# Altium schematic sheet Sheet2.SchDoc
size A; SheetNumber: 2; SheetTotal: 2
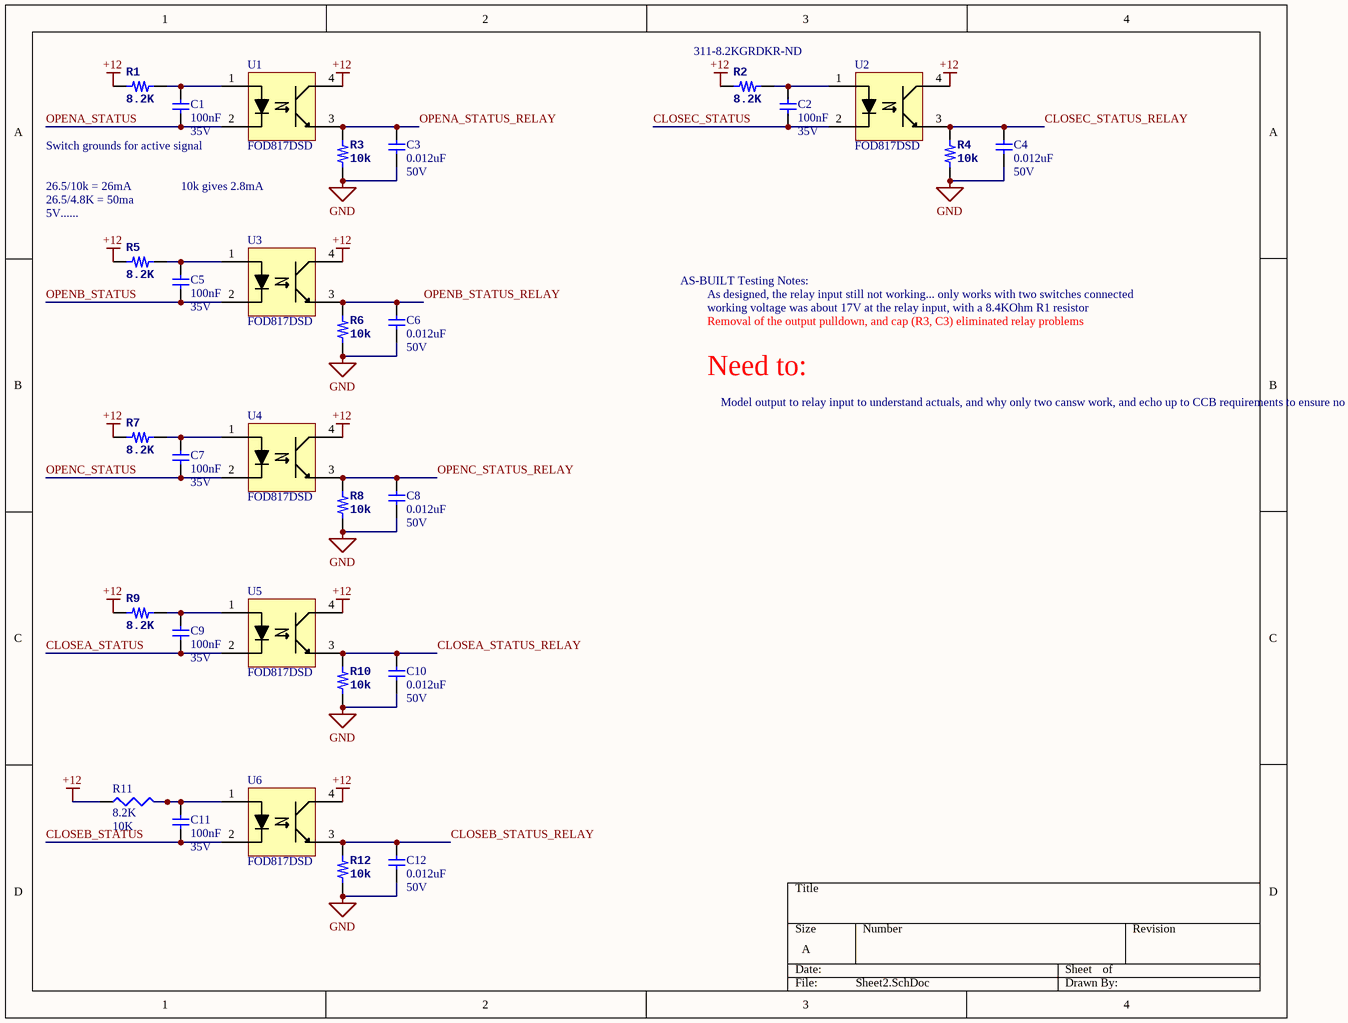
[diagram p0: Sheet2.SchDoc]

## Parts
C1  100nF  Voltage: 35V  [C0603N]
C2  100nF  Voltage: 35V  [C0603N]
C3  0.012uF  Voltage: 50V  [C0805K]
C4  0.012uF  Voltage: 50V  [C0805K]
C5  100nF  Voltage: 35V  [C0603N]
C6  0.012uF  Voltage: 50V  [C0805K]
C7  100nF  Voltage: 35V  [C0603N]
C8  0.012uF  Voltage: 50V  [C0805K]
C9  100nF  Voltage: 35V  [C0603N]
C10  0.012uF  Voltage: 50V  [C0805K]
C11  100nF  Voltage: 35V  [C0603N]
C12  0.012uF  Voltage: 50V  [C0805K]
R1  8.2K  [R0603N]
R2  8.2K  Supplier Part Number 1: 311-8.2KGRDKR-ND  [R0603N]
R3  10k  [R0603N]
R4  10k  [R0603N]
R5  8.2K  [R0603N]
R6  10k  [R0603N]
R7  8.2K  [R0603N]
R8  10k  [R0603N]
R9  8.2K  [R0603N]
R10  10k  [R0603N]
R11  8.2K  value 10K  [J1-0603]
R12  10k  [R0603N]
U1  FOD817DSD  [4-SMD GullWing]
U2  FOD817DSD  [4-SMD GullWing]
U3  FOD817DSD  [4-SMD GullWing]
U4  FOD817DSD  [4-SMD GullWing]
U5  FOD817DSD  [4-SMD GullWing]
U6  FOD817DSD  [4-SMD GullWing]

## Nets
+12: R1.2 R2.2 R5.2 R7.2 R9.2 R11.1 U1.4(C) U2.4(C) U3.4(C) U4.4(C) U5.4(C) U6.4(C)
GND: C3.2 C4.2 C6.2 C8.2 C10.2 C12.2 R3.1 R4.1 R6.1 R8.1 R10.1 R12.1
CLOSEA_STATUS: C9.2 U5.2(C)
CLOSEA_STATUS_RELAY: C10.1 R10.2 U5.3(E)
CLOSEB_STATUS: C11.2 U6.2(C)
CLOSEB_STATUS_RELAY: C12.1 R12.2 U6.3(E)
CLOSEC_STATUS: C2.2 U2.2(C)
CLOSEC_STATUS_RELAY: C4.1 R4.2 U2.3(E)
OPENA_STATUS: C1.2 U1.2(C)
OPENA_STATUS_RELAY: C3.1 R3.2 U1.3(E)
OPENB_STATUS: C5.2 U3.2(C)
OPENB_STATUS_RELAY: C6.1 R6.2 U3.3(E)
OPENC_STATUS: C7.2 U4.2(C)
OPENC_STATUS_RELAY: C8.1 R8.2 U4.3(E)
NetC1_1: C1.1 R1.1 U1.1(A)
NetC2_1: C2.1 R2.1 U2.1(A)
NetC5_1: C5.1 R5.1 U3.1(A)
NetC7_1: C7.1 R7.1 U4.1(A)
NetC9_1: C9.1 R9.1 U5.1(A)
NetC11_1: C11.1 R11.2 U6.1(A)

## Notes on the sheet
- Switch grounds for active signal
- 26.5/10k = 26mA
- 26.5/4.8K = 50ma
- (near R5) 5V......
- 10k gives 2.8mA
- AS-BUILT Testing Notes:
- As designed, the relay input still not working... only works with two switches connected
- working voltage was about 17V at the relay input, with a 8.4KOhm R1 resistor
- Removal of the output pulldown, and cap (R3, C3) eliminated relay problems
- Need to:
- Model output to relay input to understand actuals, and why only two cansw work, and echo up to CCB requirements to ensure no future problems

## Library data of the parts
C1 C2 C5 C7 C9 C11 = CAP_0603: CAP CER 10% 0603; Temp: X7R; Part Number: ?; Manufacturer: ?; PartNumber-Prime: ?; Mount: SMT; Alternate Allowed: ?
C3 C4 C6 C8 C10 C12 = CAP_0805: CAP CER 10% 0805; PartNumber: ?; Manufacturer: ?; PartNumber-Prime: ?; Mount: SMT; Alternate Allowed: ?; Temp: ?
R1 R2 R5 R7 R9 = RES_1/10W_0603_1%: RES SMD 1/10W 0603 1%; Manufacturer: ?; Manufacturer Part Number: ?; Part Number-Prime: ?; Power: 1/10W; Tolerance: 1%; Mount: SMT; Alternate Allowed: ?
  R2: Supplier 1: Digi-Key
R3 R4 R6 R8 R10 R12 = RES_1/10W_0603_0.1%: RES SMD 1/10W 0603 0.1%; Manufacturer: ?; Manufacturer Part Number: ?; Part Number-Prime: ?; Power: 1/10W; Mount: SMT; Alternate Allowed: ?; Tolerance: 0.1%
R11 = Res3: Resistor; Published: 8-Jun-2000; LatestRevisionDate: 29-May-2009; LatestRevisionNote: IPC-7351 Footprint Added.; PackageReference: J1-0603; Publisher: Altium Limited; PackageDescription: Chip Resistor
U1-U6 = 108-00030-001: OPTOISOLATOR 5KV TRANSISTOR 4SMD; Manufacturer: Fairchild; Temp: -55C, +110C; Supplier 1: Digi-Key; Supplier Part Number 1: FOD817DSDCT-ND; Mount: SMT; Manufacturer Part Number: FOD817DSD; Part Number-Prime: ?; Price: 0.30; Part Number-ASD: 108-00030-001